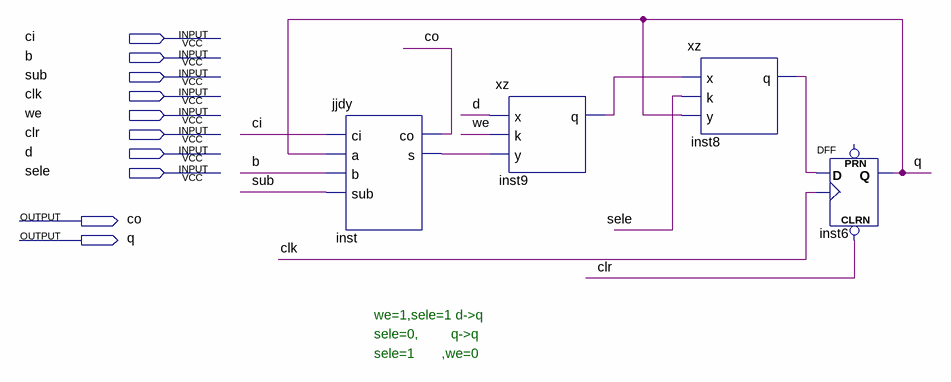
[diagram p0: schematic sheet]
// Quartus schematic jshdy.bdf as structural Verilog: 4 symbols, 10 pins
module jshdy (
  input  ci,
  input  b,
  input  sub,
  input  clk,
  input  we,
  input  clr,
  input  d,
  input  sele,
  output co,
  output q
);

  wire inst8_q, inst9_q, inst_s;

  jjdy inst (.ci(ci), .a(q), .b(b), .sub(sub), .co(co), .s(inst_s));
  xz inst9 (.x(d), .k(we), .y(inst_s), .q(inst9_q));
  xz inst8 (.x(inst9_q), .k(sele), .y(q), .q(inst8_q));
  DFF inst6 (.CLRN(clr), .CLK(clk), .D(inst8_q), .Q(q));  // open: PRN

  // Notes on the sheet:
  //   we=1,sele=1 d->q
  //   sele=0,
  //   q->q
  //   sele=1
  //   ,we=0
endmodule
